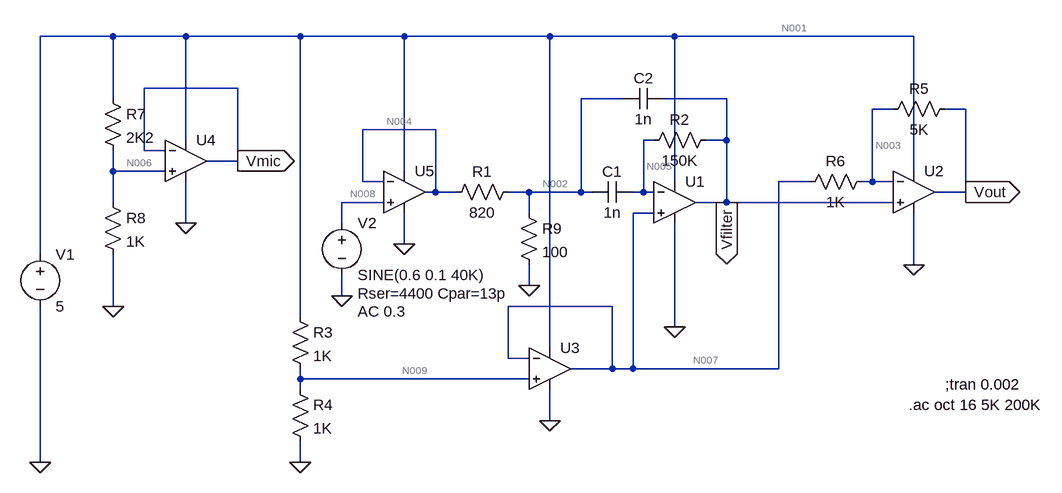
[diagram p0: schematic bpf.asc]
bpf.asc, the LTspice schematic file:
Version 4
SHEET 1 1016 692
WIRE -448 16 -560 16
WIRE -336 16 -448 16
WIRE -160 16 -336 16
WIRE 0 16 -160 16
WIRE 224 16 0 16
WIRE 416 16 224 16
WIRE 784 16 416 16
WIRE -256 96 -400 96
WIRE -448 112 -448 16
WIRE 336 112 272 112
WIRE 496 112 400 112
WIRE 752 128 720 128
WIRE 864 128 832 128
WIRE 48 160 -64 160
WIRE -336 176 -336 16
WIRE 384 176 368 176
WIRE 496 176 496 112
WIRE 496 176 464 176
WIRE -400 192 -400 96
WIRE -368 192 -400 192
WIRE -256 208 -256 96
WIRE -256 208 -304 208
WIRE -448 224 -448 192
WIRE -368 224 -448 224
WIRE 0 224 0 16
WIRE 784 224 784 16
WIRE -64 240 -64 160
WIRE -32 240 -64 240
WIRE 416 240 416 16
WIRE 624 240 576 240
WIRE 720 240 720 128
WIRE 720 240 704 240
WIRE 752 240 720 240
WIRE 48 256 48 160
WIRE 48 256 32 256
WIRE 80 256 48 256
WIRE 192 256 160 256
WIRE 272 256 272 112
WIRE 272 256 192 256
WIRE 288 256 272 256
WIRE 368 256 368 176
WIRE 368 256 352 256
WIRE 384 256 368 256
WIRE 864 256 864 128
WIRE 864 256 816 256
WIRE -448 272 -448 224
WIRE -32 272 -96 272
WIRE 496 272 496 176
WIRE 496 272 448 272
WIRE 752 272 496 272
WIRE 192 288 192 256
WIRE 384 288 352 288
WIRE -336 304 -336 240
WIRE -96 304 -96 272
WIRE 0 336 0 288
WIRE -560 352 -560 16
WIRE 784 368 784 288
WIRE 192 400 192 368
WIRE -96 416 -96 384
WIRE -448 432 -448 352
WIRE 320 432 160 432
WIRE -160 448 -160 16
WIRE 416 464 416 304
WIRE 224 496 224 16
WIRE 160 512 160 432
WIRE 192 512 160 512
WIRE 320 528 320 432
WIRE 320 528 256 528
WIRE 352 528 352 288
WIRE 352 528 320 528
WIRE 576 528 576 240
WIRE 576 528 352 528
WIRE -160 544 -160 528
WIRE 192 544 -160 544
WIRE -160 560 -160 544
WIRE 224 608 224 560
WIRE -560 672 -560 432
WIRE -160 672 -160 640
FLAG -560 672 0
FLAG -96 416 0
FLAG 416 464 0
FLAG 496 272 Vfilter
IOPIN 496 272 Out
FLAG -160 672 0
FLAG 784 368 0
FLAG 224 608 0
FLAG 864 256 Vout
IOPIN 864 256 Out
FLAG -448 432 0
FLAG -336 304 0
FLAG -256 208 Vmic
IOPIN -256 208 Out
FLAG 0 336 0
FLAG 192 400 0
SYMBOL voltage -560 336 R0
WINDOW 123 0 0 Left 2
WINDOW 39 0 0 Left 2
SYMATTR InstName V1
SYMATTR Value 5
SYMBOL voltage -96 288 R0
WINDOW 123 24 152 Left 2
WINDOW 39 24 124 Left 2
SYMATTR Value2 AC 0.3
SYMATTR SpiceLine Rser=4400 Cpar=13p
SYMATTR InstName V2
SYMATTR Value SINE(0.6 0.1 40K)
SYMBOL Opamps\\UniversalOpamp2 416 272 R0
SYMATTR InstName U1
SYMBOL cap 352 240 R90
WINDOW 0 0 32 VBottom 2
WINDOW 3 32 32 VTop 2
SYMATTR InstName C1
SYMATTR Value 1n
SYMBOL cap 400 96 R90
WINDOW 0 0 32 VBottom 2
WINDOW 3 32 32 VTop 2
SYMATTR InstName C2
SYMATTR Value 1n
SYMBOL res 480 160 R90
WINDOW 0 0 56 VBottom 2
WINDOW 3 32 56 VTop 2
SYMATTR InstName R2
SYMATTR Value 150K
SYMBOL res -176 432 R0
SYMATTR InstName R3
SYMATTR Value 1K
SYMBOL res -176 544 R0
SYMATTR InstName R4
SYMATTR Value 1K
SYMBOL Opamps\\UniversalOpamp2 784 256 R0
SYMATTR InstName U2
SYMBOL Opamps\\UniversalOpamp2 224 528 R0
SYMATTR InstName U3
SYMBOL res 848 112 R90
WINDOW 0 0 56 VBottom 2
WINDOW 3 32 56 VTop 2
SYMATTR InstName R5
SYMATTR Value 5K
SYMBOL res 720 224 R90
WINDOW 0 0 56 VBottom 2
WINDOW 3 32 56 VTop 2
SYMATTR InstName R6
SYMATTR Value 1K
SYMBOL res -464 96 R0
SYMATTR InstName R7
SYMATTR Value 2K2
SYMBOL res -464 256 R0
SYMATTR InstName R8
SYMATTR Value 1K
SYMBOL Opamps\\UniversalOpamp2 -336 208 R0
SYMATTR InstName U4
SYMBOL Opamps\\UniversalOpamp2 0 256 R0
SYMATTR InstName U5
SYMBOL res 176 240 R90
WINDOW 0 0 56 VBottom 2
WINDOW 3 32 56 VTop 2
SYMATTR InstName R1
SYMATTR Value 820
SYMBOL res 176 272 R0
SYMATTR InstName R9
SYMATTR Value 100
TEXT 832 552 Left 2 !;tran 0.002
TEXT 776 584 Left 2 !.ac oct 16 5K 200K

The netlist it stands for:
* bpf.asc
V1 N001 0 5
V2 N008 0 SINE(0.6 0.1 40K) AC 0.3 Rser=4400 Cpar=13p
XU1 N007 N005 N001 0 Vfilter level.2 Avol=1Meg GBW=10Meg Slew=10Meg ilimit=25m rail=0 Vos=0 phimargin=45 en=0 enk=0 in=0 ink=0 Rin=500Meg  ; pins IN+ IN- V+ V- OUT
C1 N005 N002 1n
C2 Vfilter N002 1n
R2 Vfilter N005 150K
R3 N001 N009 1K
R4 N009 0 1K
XU2 Vfilter N003 N001 0 Vout level.2 Avol=1Meg GBW=10Meg Slew=10Meg ilimit=25m rail=0 Vos=0 phimargin=45 en=0 enk=0 in=0 ink=0 Rin=500Meg  ; pins IN+ IN- V+ V- OUT
XU3 N009 N007 N001 0 N007 level.2 Avol=1Meg GBW=10Meg Slew=10Meg ilimit=25m rail=0 Vos=0 phimargin=45 en=0 enk=0 in=0 ink=0 Rin=500Meg  ; pins IN+ IN- V+ V- OUT
R5 Vout N003 5K
R6 N003 N007 1K
R7 N001 N006 2K2
R8 N006 0 1K
XU4 N006 Vmic N001 0 Vmic level.2 Avol=1Meg GBW=10Meg Slew=10Meg ilimit=25m rail=0 Vos=0 phimargin=45 en=0 enk=0 in=0 ink=0 Rin=500Meg  ; pins IN+ IN- V+ V- OUT
XU5 N008 N004 N001 0 N004 level.2 Avol=1Meg GBW=10Meg Slew=10Meg ilimit=25m rail=0 Vos=0 phimargin=45 en=0 enk=0 in=0 ink=0 Rin=500Meg  ; pins IN+ IN- V+ V- OUT
R1 N002 N004 820
R9 N002 0 100
;tran 0.002
.ac oct 16 5K 200K
.lib UniversalOpamps2.sub
.backanno
.end

* Results of the author's LTspice run, read from the files saved beside the schematic
* Operating Point, zero values left out:
*   V(n001) = 5 V
*   V(n008) = 600 mV
*   V(vfilter) = 2.5 V
*   V(n005) = 2.5 V
*   V(n007) = 2.5 V
*   V(n002) = 65.22 mV
*   V(n009) = 2.5 V
*   V(vout) = 2.5 V
*   V(n003) = 2.5 V
*   V(n006) = 1.563 V
*   V(vmic) = 1.563 V
*   V(n004) = 600 mV
*   I(R9) = 652.2 µA
*   I(R1) = -652.2 µA
*   I(R8) = 1.563 mA
*   I(R7) = 1.562 mA
*   I(R4) = 2.5 mA
*   I(R3) = 2.5 mA
*   I(V2) = 3.8 nA
*   I(V1) = -5.735 mA
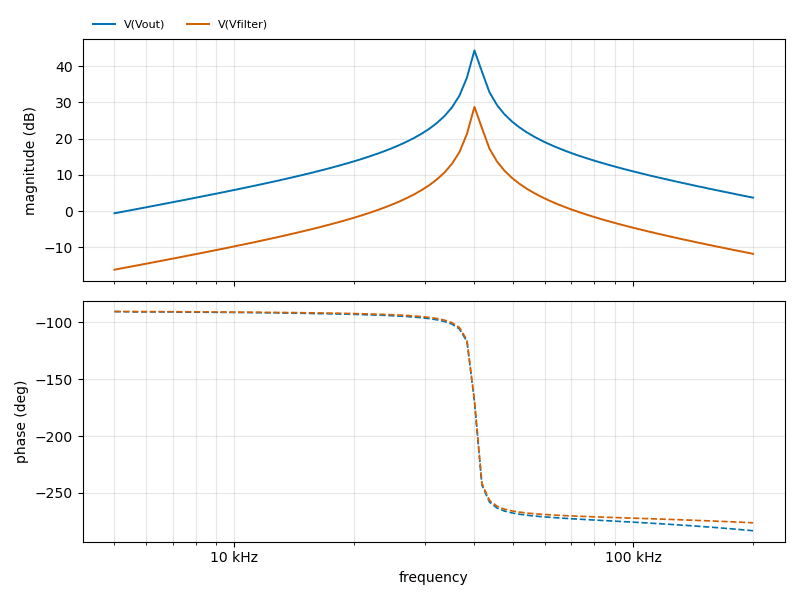
[diagram p1: AC Analysis of bpf.asc, plotted from the saved traces]
* AC Analysis, 1 run:
*   V(Vout): -0.57 dB at 5 kHz, 3.74 dB at 200 kHz, peak 44.36 dB at 40 kHz, 3 dB below the peak at 39.31 kHz and 40.9 kHz
*   V(Vfilter): -16.13 dB at 5 kHz, -11.76 dB at 200 kHz, peak 28.80 dB at 40 kHz, 3 dB below the peak at 39.31 kHz and 40.9 kHz